# Altium schematic sheet Support_GATEWAY.SchDoc
size A
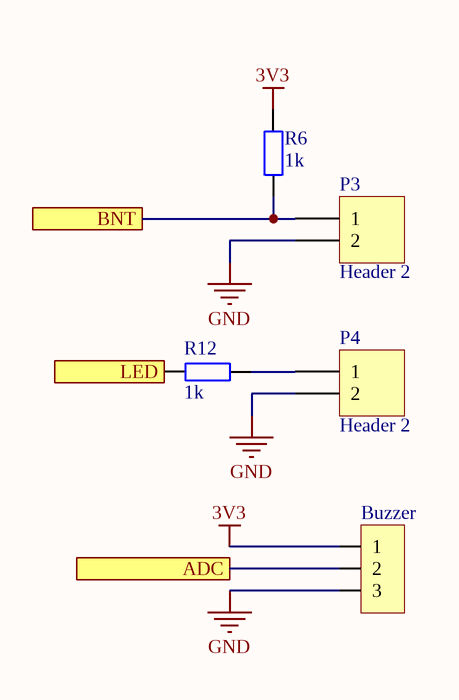
[diagram p0: Support_GATEWAY.SchDoc]

## Parts
JP3  Buzzer  [JP3]
P3  Header 2  [Header 2]
P4  Header 2  [Header 2]
R6  1k  [RES-SMD-0603]
R12  1k  [RES-SMD-0603]

## Ports
ADC, BNT, LED

## Nets
3V3: JP3.1 R6.2
GND: JP3.3 P3.2 P4.2
ADC: JP3.2 ; port ADC
BNT: P3.1 R6.1 ; port BNT
LED: R12.1 ; port LED
NetP4_1: P4.1 R12.2

## Library data of the parts
JP3 = JP 1x3 2.54 Cai Thang: Cắm; Ten_Linh_Kien: Jump Đơn Cái 2.54MM 1x20P Thẳng; Don_Vi: Con; Ma_Hang: MH004006; Ghi_Chu: *; Kieu_Chan: *; Chung_Loai: Cắm
P3 P4 = Header 2: Header, 2-Pin; LatestRevisionDate: 17-Jul-2002; LatestRevisionNote: Re-released for DXP Platform.; Publisher: Altium Limited
R6 R12 = Resistor - SMD: Resistor SMD; Manufacturer: Generic Components; Class: Passive; Published: 08/06/2000; Publisher: Altium Hobart Technology Centre